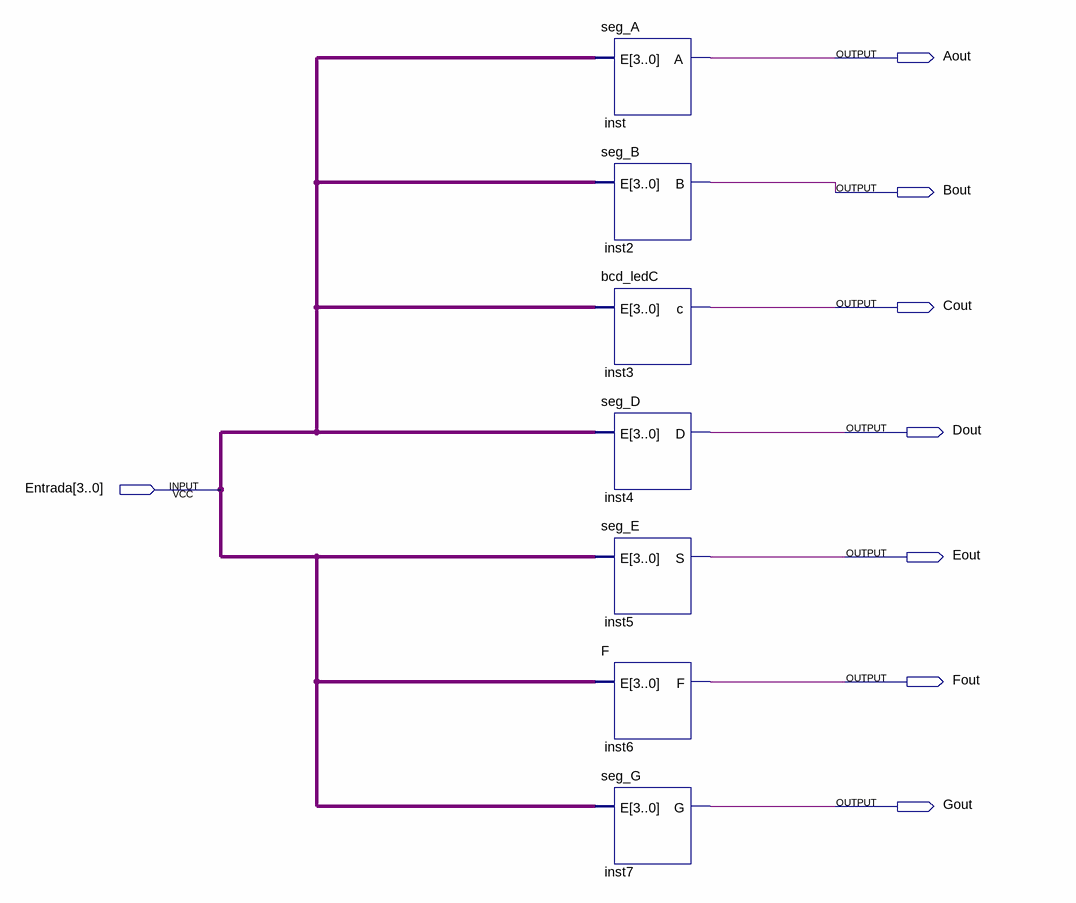
[diagram p0: schematic sheet]
// Quartus schematic BCD-7seg.bdf as structural Verilog: 7 symbols, 8 pins
module \BCD-7seg  (
  input  [3:0] Entrada,
  output Aout,
  output Bout,
  output Cout,
  output Dout,
  output Eout,
  output Fout,
  output Gout
);

  seg_A inst (.E(Entrada), .A(Aout));
  seg_B inst2 (.E(Entrada), .B(Bout));
  bcd_ledC inst3 (.E(Entrada), .c(Cout));
  seg_D inst4 (.E(Entrada), .D(Dout));
  seg_E inst5 (.E(Entrada), .S(Eout));
  F inst6 (.E(Entrada), .F(Fout));
  seg_G inst7 (.E(Entrada), .G(Gout));
endmodule
